# Altium project LEDCube_Rev2.PrjPCB
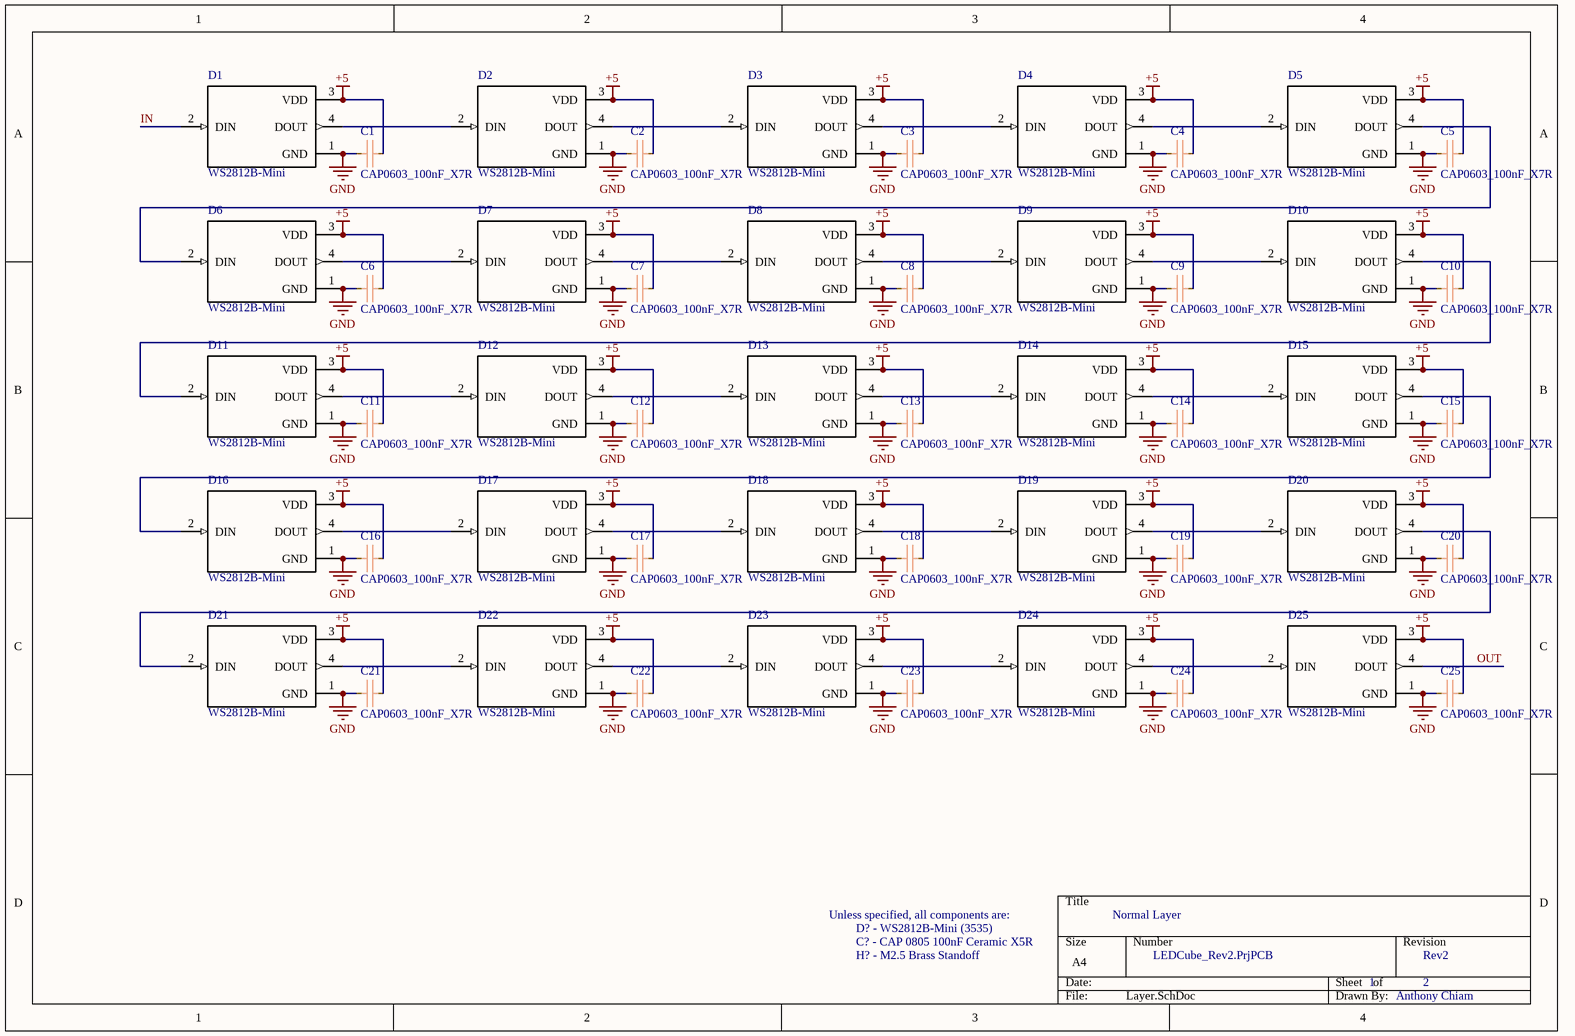
[diagram p0: Layer.SchDoc]
1 sheet, 50 parts. Net scope: global (net labels, ports and power ports of the same name join across sheets).
Board files: InvertedLayer.PcbDoc, Layer.PcbDoc

## Sheet Layer.SchDoc: Normal Layer
size A4; Date: 25/10/2019; CheckedBy: Anthony Chiam; Author: Anthony Chiam; DrawnBy: Anthony Chiam; Engineer: Anthony Chiam; Revision: Rev2; SheetNumber: 1; SheetTotal: 2

### Parts
C1  CAP0603_100nF_X7R  [C0603]
C2  CAP0603_100nF_X7R  [C0603]
C3  CAP0603_100nF_X7R  [C0603]
C4  CAP0603_100nF_X7R  [C0603]
C5  CAP0603_100nF_X7R  [C0603]
C6  CAP0603_100nF_X7R  [C0603]
C7  CAP0603_100nF_X7R  [C0603]
C8  CAP0603_100nF_X7R  [C0603]
C9  CAP0603_100nF_X7R  [C0603]
C10  CAP0603_100nF_X7R  [C0603]
C11  CAP0603_100nF_X7R  [C0603]
C12  CAP0603_100nF_X7R  [C0603]
C13  CAP0603_100nF_X7R  [C0603]
C14  CAP0603_100nF_X7R  [C0603]
C15  CAP0603_100nF_X7R  [C0603]
C16  CAP0603_100nF_X7R  [C0603]
C17  CAP0603_100nF_X7R  [C0603]
C18  CAP0603_100nF_X7R  [C0603]
C19  CAP0603_100nF_X7R  [C0603]
C20  CAP0603_100nF_X7R  [C0603]
C21  CAP0603_100nF_X7R  [C0603]
C22  CAP0603_100nF_X7R  [C0603]
C23  CAP0603_100nF_X7R  [C0603]
C24  CAP0603_100nF_X7R  [C0603]
C25  CAP0603_100nF_X7R  [C0603]
D1  WS2812B-Mini  [WS2812B-3535]
D2  WS2812B-Mini  [WS2812B-3535]
D3  WS2812B-Mini  [WS2812B-3535]
D4  WS2812B-Mini  [WS2812B-3535]
D5  WS2812B-Mini  [WS2812B-3535]
D6  WS2812B-Mini  [WS2812B-3535]
D7  WS2812B-Mini  [WS2812B-3535]
D8  WS2812B-Mini  [WS2812B-3535]
D9  WS2812B-Mini  [WS2812B-3535]
D10  WS2812B-Mini  [WS2812B-3535]
D11  WS2812B-Mini  [WS2812B-3535]
D12  WS2812B-Mini  [WS2812B-3535]
D13  WS2812B-Mini  [WS2812B-3535]
D14  WS2812B-Mini  [WS2812B-3535]
D15  WS2812B-Mini  [WS2812B-3535]
D16  WS2812B-Mini  [WS2812B-3535]
D17  WS2812B-Mini  [WS2812B-3535]
D18  WS2812B-Mini  [WS2812B-3535]
D19  WS2812B-Mini  [WS2812B-3535]
D20  WS2812B-Mini  [WS2812B-3535]
D21  WS2812B-Mini  [WS2812B-3535]
D22  WS2812B-Mini  [WS2812B-3535]
D23  WS2812B-Mini  [WS2812B-3535]
D24  WS2812B-Mini  [WS2812B-3535]
D25  WS2812B-Mini  [WS2812B-3535]

### Nets
+5: C1.2(N/A) C2.1(N/A) C3.1(N/A) C4.1(N/A) C5.1(N/A) C6.2(N/A) C7.2(N/A) C8.2(N/A) C9.2(N/A) C10.2(N/A) C11.2(N/A) C12.2(N/A) C13.2(N/A) C14.2(N/A) C15.2(N/A) C16.2(N/A) C17.2(N/A) C18.2(N/A) C19.2(N/A) C20.2(N/A) C21.2(N/A) C22.2(N/A) C23.2(N/A) C24.2(N/A) C25.2(N/A) D1.3(VDD) D2.3(VDD) D3.3(VDD) D4.3(VDD) D5.3(VDD) D6.3(VDD) D7.3(VDD) D8.3(VDD) D9.3(VDD) D10.3(VDD) D11.3(VDD) D12.3(VDD) D13.3(VDD) D14.3(VDD) D15.3(VDD) D16.3(VDD) D17.3(VDD) D18.3(VDD) D19.3(VDD) D20.3(VDD) D21.3(VDD) D22.3(VDD) D23.3(VDD) D24.3(VDD) D25.3(VDD)
GND: C1.1(N/A) C2.2(N/A) C3.2(N/A) C4.2(N/A) C5.2(N/A) C6.1(N/A) C7.1(N/A) C8.1(N/A) C9.1(N/A) C10.1(N/A) C11.1(N/A) C12.1(N/A) C13.1(N/A) C14.1(N/A) C15.1(N/A) C16.1(N/A) C17.1(N/A) C18.1(N/A) C19.1(N/A) C20.1(N/A) C21.1(N/A) C22.1(N/A) C23.1(N/A) C24.1(N/A) C25.1(N/A) D1.1(GND) D2.1(GND) D3.1(GND) D4.1(GND) D5.1(GND) D6.1(GND) D7.1(GND) D8.1(GND) D9.1(GND) D10.1(GND) D11.1(GND) D12.1(GND) D13.1(GND) D14.1(GND) D15.1(GND) D16.1(GND) D17.1(GND) D18.1(GND) D19.1(GND) D20.1(GND) D21.1(GND) D22.1(GND) D23.1(GND) D24.1(GND) D25.1(GND)
IN: D1.2(DIN)
OUT: D25.4(DOUT)
NetD1_4: D1.4(DOUT) D2.2(DIN)
NetD2_4: D2.4(DOUT) D3.2(DIN)
NetD3_4: D3.4(DOUT) D4.2(DIN)
NetD4_4: D4.4(DOUT) D5.2(DIN)
NetD5_4: D5.4(DOUT) D6.2(DIN)
NetD6_4: D6.4(DOUT) D7.2(DIN)
NetD7_4: D7.4(DOUT) D8.2(DIN)
NetD8_4: D8.4(DOUT) D9.2(DIN)
NetD9_4: D9.4(DOUT) D10.2(DIN)
NetD10_4: D10.4(DOUT) D11.2(DIN)
NetD11_4: D11.4(DOUT) D12.2(DIN)
NetD12_4: D12.4(DOUT) D13.2(DIN)
NetD13_4: D13.4(DOUT) D14.2(DIN)
NetD14_4: D14.4(DOUT) D15.2(DIN)
NetD15_4: D15.4(DOUT) D16.2(DIN)
NetD16_4: D16.4(DOUT) D17.2(DIN)
NetD17_4: D17.4(DOUT) D18.2(DIN)
NetD18_4: D18.4(DOUT) D19.2(DIN)
NetD19_4: D19.4(DOUT) D20.2(DIN)
NetD20_4: D20.4(DOUT) D21.2(DIN)
NetD21_4: D21.4(DOUT) D22.2(DIN)
NetD22_4: D22.4(DOUT) D23.2(DIN)
NetD23_4: D23.4(DOUT) D24.2(DIN)
NetD24_4: D24.4(DOUT) D25.2(DIN)

### Notes on the sheet
- Unless specified, all components are:
- D? - WS2812B-Mini (3535)
- C? - CAP 0805 100nF Ceramic X5R
- H? - M2.5 Brass Standoff

### Library data of the parts
C1-C25 = CAP: CAP0603 100nF X5R/X7R 25V; MF: Samsung Electro-Mechanics; MP: CL10B104KA8NNNC; LCSC Part #: C1590; Footprint: 0603
D1-D25 = WS2812B-3535: WS2812B-Mini 35x35mm; MF: Worldsemi; MP: WS2812B-Mini; LCSC Part #: C114583; Footprint: SMD,3.5x3.5mm